# Altium schematic sheet Power.SchDoc
size A; SheetNumber: 2; SheetTotal: 5
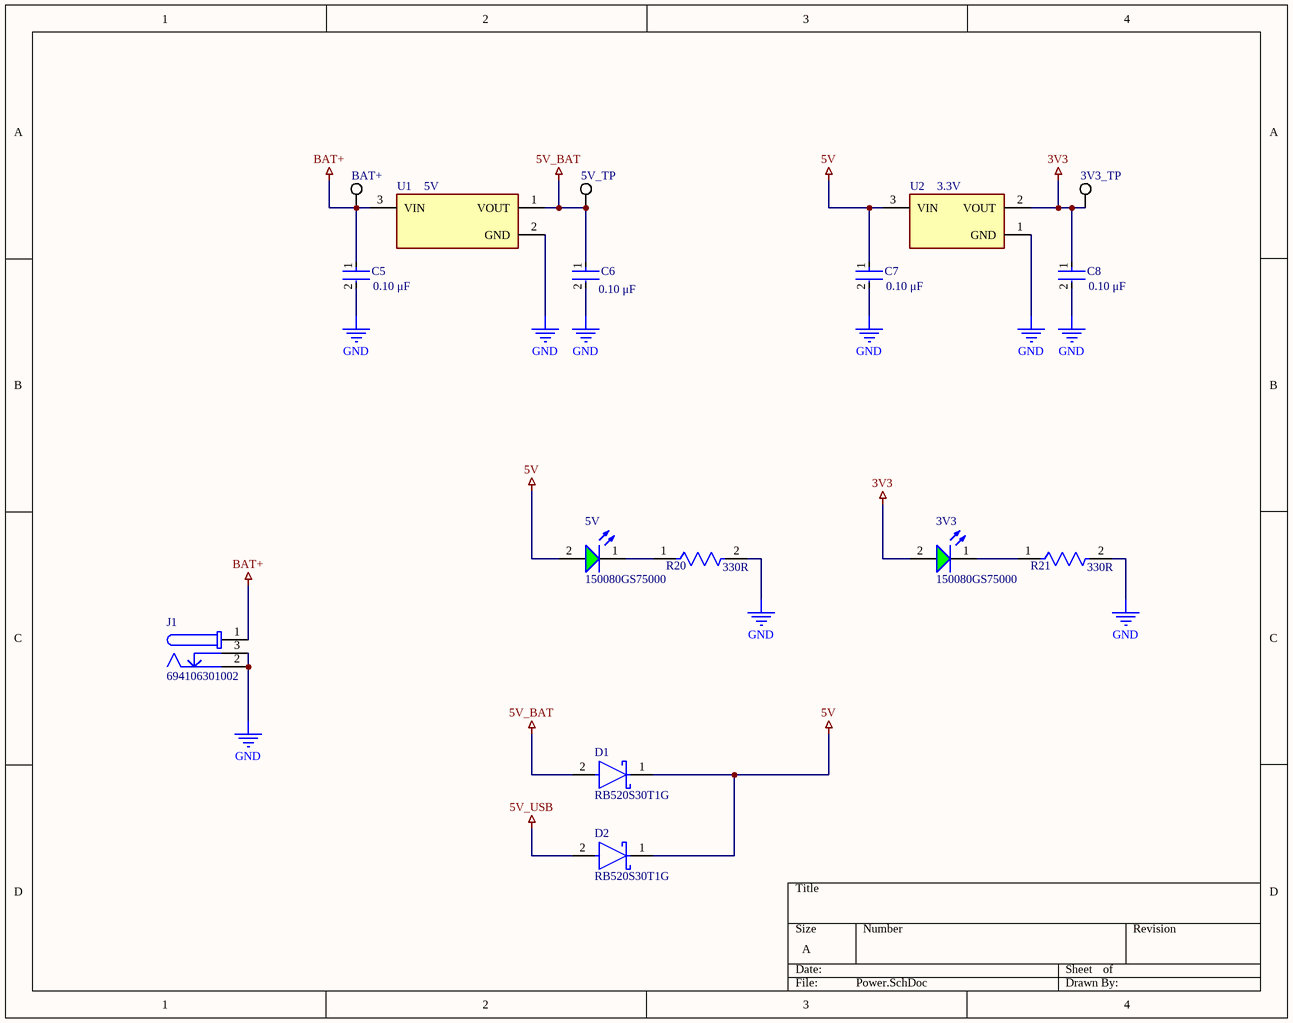
[diagram p0: Power.SchDoc]

## Parts
3V3  150080GS75000  [WL-SMCW_0805_150080xx75000]
3V3_TP  (no value)  [KSTN-5019_V]
5V  150080GS75000  [WL-SMCW_0805_150080xx75000]
5V_TP  (no value)  [KSTN-5019_V]
BAT+  (no value)  [KSTN-5019_V]
C5  Capacitance: 0.10 μF  [FP-C0603C-CF-MFG]  (hidden comment: C0603C104K5RACTU)
C6  Capacitance: 0.10 μF  [FP-C0603C-CF-MFG]  (hidden comment: C0603C104K5RACTU)
C7  Capacitance: 0.10 μF  [FP-C0603C-CF-MFG]  (hidden comment: C0603C104K5RACTU)
C8  Capacitance: 0.10 μF  [FP-C0603C-CF-MFG]  (hidden comment: C0603C104K5RACTU)
D1  RB520S30T1G  [FP-502-01-MFG]
D2  RB520S30T1G  [FP-502-01-MFG]
J1  694106301002  [694106301002]
R20  Resistance: 330R  [FP-CRCW0805-e3-MFG]  (hidden comment: CRCW0805330RFKEA)
R21  Resistance: 330R  [FP-CRCW0805-e3-MFG]  (hidden comment: CRCW0805330RFKEA)
U1  Output Voltage: 5V  [FP-SOT-89-7098166-MFG]  (hidden comment: L78L05ACUTR)
U2  Output Voltage: 3.3V  [FP-SOT23-MFG]  (hidden comment: AP2120N-3.3TRG1)

## Nets
3V3: 3V3.2(A) 3V3_TP.1 C8.1 U2.2(VOUT)
5V: 5V.2(A) C7.1 D1.1(C) D2.1(C) U2.3(VIN)
5V_BAT: 5V_TP.1 C6.1 D1.2(A) U1.1(VOUT)
5V_USB: D2.2(A)
BAT+: BAT+.1 C5.1 J1.1 U1.3(VIN)
GND: C5.2 C6.2 C7.2 C8.2 J1.2 J1.3 R20.2 R21.2 U1.2(GND) U2.1(GND)
Net3V3_1: 3V3.1(K) R21.1
Net5V_1: 5V.1(K) R20.1

## Library data of the parts
3V3 5V = CMP-1426-00007-2: NexarPartId: 29717780; Manufacturer: Wurth Electronics; Wavelength: 520nm; Forward Current: 100mA; Lens Style: Clear, Rectangular; Dominant Wavelength: 525nm; Max Junction Temperature (Tj): 95°C; Power Dissipation: 105mW; Luminous Intensity: 450mcd; Peak Wavelength: 515nm; Viewing Angle: 140°; Test Current: 20mA; Reverse Voltage: 5V; Forward Voltage: 3.2V; Description: Single Color LED, Green, Water Clear, 1.4mm; Shape: Rectangular; Channels: 1; Optoelectronic Device Type: SINGLE COLOR LED; Overall Height: 0.7mm; Mount: Surface Mount; REACH SVHC: Unknown; Min Operating Temperature: -40°C; Case Code (Imperial): 0805; Case/Package: 0805; Max Operating Temperature: 85°C; RoHS: Compliant; Length: 2mm; Height: 700µm; Width: 1.25mm; Color: Green; Case Code (Metric): 2012; Packaging: Tape and Reel; Max Reverse Voltage (DC): 5V; Supplier: Digikey; Supplier Part Number: 732-4983-1-ND; Manufacturer Part Number: 150080GS75000; Category: LEDs; Stock: 74088; Pricing: 1=0.19, 50=0.176, 100=0.151, 500=0.131 (USD); Mounting Technology: Surface Mount; Pins: 2; Luminous Intensity-Nom: 450mcd; Size: 1.4mm; Terminal Pitch: 2.1mm; Reach SVHC Compliant: Yes; RoHS Compliant: Yes; ComponentLink1URL: https://datasheet.ciiva.com:443/pdfs/VipMasterIC/IC/MIDC/MIDC-S-A0007455966/MIDC-S-A0007455966-1.pdf?src-supplier=IHS+Markit; ComponentLink1Description: https://datasheet.ciiva.com:443/pdfs/VipMasterIC/IC/MIDC/MIDC-S-A0007455966/MIDC-S-A0007455966-1.pdf?src-supplier=IHS+Markit; ComponentLink2URL: https://datasheet.ciiva.com/29563/150080gs75000-29563008.pdf?src-supplier=Digikey; ComponentLink2Description: https://datasheet.ciiva.com/29563/150080gs75000-29563008.pdf?src-supplier=Digikey; ComponentLink3URL: https://datasheet.ciiva.com/29279/759434-da-01-en-chipled-0805-w-kl-gruen-150080gs75000-29279039.pdf?src-supplier=Conrad; ComponentLink3Description: https://datasheet.ciiva.com/29279/759434-da-01-en-chipled-0805-w-kl-gruen-150080gs75000-29279039.pdf?src-supplier=Conrad
3V3_TP 5V_TP BAT+ = CMP-1672-00008-1: Test Point, 1 Position SMD, RoHS, Tape and Reel; Manufacturer: Keystone Electronics; Manufacturer Part Number: 5019; Connector Type: Interconnection Device; ComponentLink1Description: Manufacturer URL; Package Quantity: 1000; DatasheetVersion: 03/2014; Packaging: Tape and Reel; ComponentLink2URL: http://www.keyelco.com/product-pdf.cfm?p=1357; ComponentLink1URL: http://www.keyelco.com/; Mount: Surface Mount; Contact Plating: Silver; PackageDescription: 1-Pin Surface Mount Device, Body 3.81 x 2.03 mm; Pins: 1; RoHSCompliant: True; Mounting Technology: Surface Mount; ComponentLink2Description: Datasheet; PackageReference: 5019; Supplier: Digikey; Supplier Part Number: 36-5019CT-ND; RoHS: Yes; Category: Connectors; Stock: 174520; Pricing: 1=0.34, 25=0.2736, 100=0.2234, 250=0.20064, 500=0.19152 (USD); Reach SVHC Compliant: Yes; RoHS Compliant: Yes; ComponentLink3URL: https://datasheet.ciiva.com:443/pdfs/VipMasterIC/IC/KEYC/KEYC-S-A0003063693/KEYC-S-A0003063693-1.pdf?src-supplier=IHS+Markit; ComponentLink3Description: https://datasheet.ciiva.com:443/pdfs/VipMasterIC/IC/KEYC/KEYC-S-A0003063693/KEYC-S-A0003063693-1.pdf?src-supplier=IHS+Markit; ComponentLink4URL: https://datasheet.ciiva.com/16318/m60-2p61-16318395.pdf?src-supplier=Future+Electronics; ComponentLink4Description: https://datasheet.ciiva.com/16318/m60-2p61-16318395.pdf?src-supplier=Future+Electronics; ComponentLink5URL: https://datasheet.ciiva.com/14848/m60-2p61-14848438.pdf?src-supplier=Digikey; ComponentLink5Description: https://datasheet.ciiva.com/14848/m60-2p61-14848438.pdf?src-supplier=Digikey; ComponentLink6URL: https://datasheet.ciiva.com/14848/m60-2p61-14848439.pdf?src-supplier=Digikey; ComponentLink6Description: https://datasheet.ciiva.com/14848/m60-2p61-14848439.pdf?src-supplier=Digikey; ComponentLink7URL: https://datasheet.ciiva.com/14848/m60-2p61-14848437.pdf?src-supplier=Digikey; ComponentLink7Description: https://datasheet.ciiva.com/14848/m60-2p61-14848437.pdf?src-supplier=Digikey; ComponentLink8URL: https://datasheet.ciiva.com/16885/70182998-16885945.pdf?src-supplier=Allied+Electronics; ComponentLink8Description: https://datasheet.ciiva.com/16885/70182998-16885945.pdf?src-supplier=Allied+Electronics
C5-C8 = CMP-2006-03061-2: CAP CER 0.1UF 50V X7R 0603; Manufacturer: KEMET; Tolerance: 0.1; Temperature Coefficient: 30ppm/°C; Material: Ceramic; Automotive Grade: Grade 1; Value: 0.10 μF; Multilayer: Yes; Tolerance  (fill in as +-): 10%; Temperature: -55°C to +125°C; RoHS: TRUE; Temperature Range High: +125°C; Lead Free: Yes; Octopart: https://octopart.com/c0603c104k5ractu-kemet-139244; Digikey Description: CAP CER 0.1UF 50V X7R 0603; Category: Cap; Package: C0603C-CF; ComponentLink2Description: Datasheet; Temperature Range Low: -55°C; Device Class L1: Passive Components; Voltage Rating: 50 V; Automotive: Yes; Device Class L3: Ceramic Capacitors; ComponentLink2URL: https://api.kemet.com/component-edge/download/datasheet/C0603C100J5GACAUTO.pdf; Device Class L2: Capacitors; Manufacturer Part Number: C0603C104K5RACTU; Temperature Characteristic: X7R; Height: 0.87mm; Supplier: Digikey; Supplier Part Number: 399-C0603C104K5RAC7867CT-ND; Stock: 4063890; Pricing: 1=0.11, 10=0.074, 50=0.0424, 100=0.0329, 500=0.02474, 1000=0.01944 (USD); Mounting Technology: Surface Mount; Pins: 2; Dielectric Material: Ceramic; Package Shape: Rectangular; Case/Package: 0603; Terminal Finish: Nickel; Min Operating Temperature: -55°C; Max Operating Temperature: 125°C; JESD-609 Code: e3; Capacitor Type: Ceramic; Package Style: SMTMeter; Packaging: Tape and Reel; Tolerance (fill in as +-): 10%; Rated DC Voltage (URdc): 50V; Temperature Characteristics Code: X7R; Termination: Wraparound; Length: 1.6mm; Width: 0.8mm; Reach SVHC Compliant: Yes; RoHS Compliant: Yes; ComponentLink1URL: https://datasheet.ciiva.com:443/pdfs/VipMasterIC/IC/KEME/KEME-S-A0008991654/KEME-S-A0008991654-1.pdf?src-supplier=IHS+Markit; ComponentLink1Description: https://datasheet.ciiva.com:443/pdfs/VipMasterIC/IC/KEME/KEME-S-A0008991654/KEME-S-A0008991654-1.pdf?src-supplier=IHS+Markit
D1 D2 = CMP-1055-00482-2: DIODE SCHOTTKY 30V 200MA SOD523; Element Configuration: Single; Max Reverse Leakage Current: 1uA; Power Dissipation: 200mW; Forward Voltage: 600mV; Polarity: Standard; Min Operating Temperature: -55°C; Radiation Hardening: No; Average Rectified Current: 200mA; Height: 0.7mm; Package Quantity: 1; Number of Pins: 2; Forward Current: 200mA; Packaging: Tape and Reel; Max Repetitive Reverse Voltage (Vrrm): 30V; Max Forward Surge Current (Ifsm): 200mA; Peak Reverse Current: 1uA; Max Reverse Voltage (DC): 30V; Lead Free: Lead Free; Current Rating: 200mA; Output Current: 200mA; Contact Plating: Tin; Voltage Rating (DC): 30V; Max Operating Temperature: 150°C; Width: 0.9mm; REACH SVHC: No SVHC; Case/Package: SOD-523-2; Length: 1.3mm
J1 = CMP-1502-00188-2: NexarPartId: 52676100; Manufacturer: Wurth Electronics; Voltage Rating (DC): 20V; Gender: Male; Voltage Rating: 24V; Connector Type: Power; Insulation Resistance: 100MΩ; Current Rating: 5A; Shielding: Unshielded; Number of Contacts: 3; Color: Black; Housing Material: Polyamide; Contact Gender: Female; REACH SVHC: Unknown; Termination: Through Hole; Height: 11mm; RoHS: Compliant; Mount: Through Hole; Flammability Rating: UL94 V-0; Packaging: Bulk; Min Operating Temperature: -40°C; Contact Plating: Tin; Max Operating Temperature: 85°C; Operating Supply Voltage: 24V; Contact Material: Gold, Tin; Supplier: Digikey; Supplier Part Number: 732-5930-ND; Manufacturer Part Number: 694106301002; Category: Power Connectors; Stock: 12798; Pricing: 1=1.02, 10=0.97, 50=0.86, 100=0.8, 500=0.69, 1000=0.59 (USD); Contact Finish - Mating: NOT SPECIFIED; Reach SVHC Compliant: Yes; RoHS Compliant: Yes; ComponentLink1URL: https://datasheet.ciiva.com:443/pdfs/VipMasterIC/IC/MIDC/MIDC-S-A0001192814/MIDC-S-A0001192814-1.pdf?src-supplier=IHS+Markit; ComponentLink1Description: https://datasheet.ciiva.com:443/pdfs/VipMasterIC/IC/MIDC/MIDC-S-A0001192814/MIDC-S-A0001192814-1.pdf?src-supplier=IHS+Markit; ComponentLink2URL: http://www.mouser.com/ds/2/445/6941xx301002-469315.pdf?src-supplier=Mouser; ComponentLink2Description: http://www.mouser.com/ds/2/445/6941xx301002-469315.pdf?src-supplier=Mouser; ComponentLink3URL: http://www.farnell.com/cad/2130967.pdf?src-supplier=Element14; ComponentLink3Description: http://www.farnell.com/cad/2130967.pdf?src-supplier=Element14; ComponentLink4URL: https://katalog.we-online.de/em/datasheet/6941xx301002.pdf?src-supplier=Digikey; ComponentLink4Description: https://katalog.we-online.de/em/datasheet/6941xx301002.pdf?src-supplier=Digikey
R20 R21 = CMP-2001-03823-2: RES Thick Film, 330Ω, 1%, 0.125W, 100ppm/°C, 0805; Manufacturer: Vishay; Voltage Rating (DC): 150V; Max Power Dissipation: 125mW; Rated Temperature: 70°C; Value: 330R; Package Height: 0.45mm; Package Length: 2mm; Package Width: 1.25mm; Reference Standard: AEC-Q200; Mount: Surface Mount; Packaging: Tape and Reel; Min Operating Temperature: -55°C; Military Standard: Not; Case Code (Metric): 2012; Height: 0.02inch; Voltage Rating: 150V; Case/Package: 0805; Max Operating Temperature: 155°C; Width: 0.049inch; Case Code (Imperial): 0805; Termination: SMD/SMT; Lead Free: Lead Free; Contact Plating: Tin; Package Quantity: 10; Composition: Thick Film; Length: 2mm; Features: Automotive AEC-Q200; Depth: 1.25mm; Weight: 0.000194oz; Tolerance: 1%; Power Rating: 125mW; Number of Terminations: 2; Temperature Coefficient: 100ppm/°C; Supplier: Digikey; Supplier Part Number: 541-330CCT-ND; Manufacturer Part Number: CRCW0805330RFKEA; RoHS: Yes; Category: Chip SMD Resistors; Stock: 41783; Pricing: 1=0.1, 10=0.038, 50=0.0248, 100=0.021, 500=0.01462, 1000=0.01273 (USD); Mounting Technology: Surface Mount; Pins: 2; Terminal Finish: Nickel; Package Shape: Rectangular; JESD-609 Code: e3; Construction: Chip; Resistor Type: FIXED RESISTOR; Package Style: SMTMeter; Power: 125mW; Technology: METAL GLAZE/THICK FILM; Working Voltage: 150V; Reach SVHC Compliant: Yes; RoHS Compliant: Yes; ComponentLink1URL: https://datasheet.ciiva.com:443/pdfs/VipMasterIC/IC/VISH/VISH-S-A0007266705/VISH-S-A0007266705-1.pdf?src-supplier=IHS+Markit; ComponentLink1Description: https://datasheet.ciiva.com:443/pdfs/VipMasterIC/IC/VISH/VISH-S-A0007266705/VISH-S-A0007266705-1.pdf?src-supplier=IHS+Markit
U1 = CMP-0244-00407-2: IC REG LINEAR 5V 100MA SOT89-3; Manufacturer: STMicroelectronics; Output Voltage Accuracy: 4%; Number of Regulators: 1; Polarity: Positive; Quiescent Current: 6mA; Min Input Voltage: 7V; Power Supply Rejection Ratio (PSRR): 49dB; Output Type: Fixed; Max Input Voltage: 30V; Dropout Voltage: 1.7V; Package Body Material: Plastic; Max Supply Voltage: 20V; Line Regulation-Max: 0.15%; Load Regulation-Max: 0.06%; Output Current1-Max: 70mA; Output Voltage1-Max: 5.25V; Output Voltage1-Min: 4.75V; Package Equivalence Code: TO-243; Regulator Type: FIXED POSITIVE SINGLE OUTPUT STANDARD REGULATOR; Time @ Peak Reflow Temperature-Max (s): 30s; Voltage Tolerance-Max: 5%; Qualification Status: Not Qualified; Nominal Output Voltage: 5V; Radiation Hardening: No; Number of Pins: 3; Weight: 0.004603oz; Output Current: 100mA; Width: 2.6mm; Packaging: Tape and Reel; Length: 4.6mm; Max Output Current: 100mA; Min Operating Temperature: 0°C; Package Quantity: 1; Accuracy: 4%; Case/Package: SOT-89; Lead Free: Lead Free; Height: 1.6mm; Min Output Voltage: 5V; Contact Plating: Tin; Number of Outputs: 1; REACH SVHC: No SVHC; Mount: Surface Mount; Max Operating Temperature: 125°C; Supplier: Digikey; Supplier Part Number: 497-1183-1-ND; Manufacturer Part Number: L78L05ACUTR; RoHS: Yes; Category: Voltage Regulators - Linear; Stock: 92237; Pricing: 1=0.54, 10=0.464, 25=0.4328, 100=0.3461, 250=0.32144, 500=0.27198, 1000=0.21016 (USD); Pins: 3; Package Shape: Rectangular; Terminal Finish: Tin; JESD-609 Code: e3; Adjustability: FIXED; Dropout Voltage1-Nom: 1.7V; Input Voltage Absolute-Max: 30V; JESD-30 Code: R-PSSO-F3; Moisture Sensitivity Level: 1; Channels: 1; Operating Temperature, TJ-Max: 125°C; Operating Temperature, TJ-Min: 0°C; Output Voltage1-Nom: 5V; Package Style: SMALL OUTLINEMeter; Peak Reflow Temperature (Cel): 260°C; Surface Mount: Yes; Technology: BIPOLAR; Terminal Form: Flat; Terminal Position: SINGLE; Height - Seated (Max): 1.6mm; Terminal Pitch: 1.495mm; Reach SVHC Compliant: Yes; RoHS Compliant: Yes; ComponentLink1URL: https://datasheet.ciiva.com:443/pdfs/VipMasterIC/IC/SGST/SGST-S-A0002857926/SGST-S-A0002857926-1.pdf?src-supplier=IHS+Markit; ComponentLink1Description: https://datasheet.ciiva.com:443/pdfs/VipMasterIC/IC/SGST/SGST-S-A0002857926/SGST-S-A0002857926-1.pdf?src-supplier=IHS+Markit; ComponentLink2URL: https://datasheet.ciiva.com/1511/1868798-1511940.pdf?src-supplier=Element14; ComponentLink2Description: https://datasheet.ciiva.com/1511/1868798-1511940.pdf?src-supplier=Element14; ComponentLink3URL: https://datasheet.ciiva.com/22710/1868798-22710940.pdf?src-supplier=Element14; ComponentLink3Description: https://datasheet.ciiva.com/22710/1868798-22710940.pdf?src-supplier=Element14; ComponentLink4URL: https://datasheet.ciiva.com/7992/1868798-7992600.pdf?src-supplier=Element14; ComponentLink4Description: https://datasheet.ciiva.com/7992/1868798-7992600.pdf?src-supplier=Element14; ComponentLink5URL: https://datasheet.ciiva.com/2041/cd00000446-2041791.pdf?src-supplier=Digikey; ComponentLink5Description: https://datasheet.ciiva.com/2041/cd00000446-2041791.pdf?src-supplier=Digikey; ComponentLink6URL: https://datasheet.ciiva.com/2041/cd00000446-2041790.pdf?src-supplier=Digikey; ComponentLink6Description: https://datasheet.ciiva.com/2041/cd00000446-2041790.pdf?src-supplier=Digikey; ComponentLink7URL: https://datasheet.ciiva.com/2041/cd00000446-2041792.pdf?src-supplier=Digikey; ComponentLink7Description: https://datasheet.ciiva.com/2041/cd00000446-2041792.pdf?src-supplier=Digikey; ComponentLink8URL: https://datasheet.ciiva.com/4882/cd00000446-355303-4882429.pdf?src-supplier=Mouser; ComponentLink8Description: https://datasheet.ciiva.com/4882/cd00000446-355303-4882429.pdf?src-supplier=Mouser; ComponentLink9URL: https://datasheet.ciiva.com/16393/cd00000446-16393708.pdf?src-supplier=Future+Electronics; ComponentLink9Description: https://datasheet.ciiva.com/16393/cd00000446-16393708.pdf?src-supplier=Future+Electronics
U2 = CMP-12756-000008-1: IC REG LINEAR 3.3V 150MA SOT23; Manufacturer: Diodes Inc.; Min Supply Voltage: 2V; Standoff Height: 0.013mm; Max Junction Temp: +85°C; Output Type: Fixed; Max Supply Voltage: 6V; Accuracy Percentage: 2%; Nominal Supply Current: 25uA; Dropout Voltage: 300mV; Number Of Outputs: 1; Package Body Material: Plastic; Input Voltage Absolute-Max: 6.5V; Line Regulation-Max: 0.016%; Load Regulation-Max: 0.04%; Output Current1-Max: 100mA; Output Voltage1-Max: 3.366V; Output Voltage1-Min: 3.234V; Package Equivalence Code: TO-236; Regulator Type: FIXED POSITIVE SINGLE OUTPUT LDO REGULATOR; Time @ Peak Reflow Temperature-Max (s): 30s; Qualification Status: Not Qualified; Footprint Url: https://www.diodes.com/assets/Package-Files/SOT23.pdf; Category: IC; Manufacturer Part Number: AP2120N-3.3TRG1; ComponentLink2Description: Datasheet; Device Class L1: Integrated Circuits (ICs); Octopart: https://octopart.com/ap2120n-3.3trg1-diodes+inc.-30954573; Temperature Range Low: -40°C; Temperature: -40°C to +85°C; Temperature Range High: +85°C; Package: SOT23; Digikey Description: IC REG LINEAR 3.3V 150MA SOT23; Height: 1.1mm; Mouser Description: AP2120 Series 3.3 V 0.15 A Surface Mount CMOS LDO Regulator - SOT23; RoHS: TRUE; ComponentLink2URL: https://www.diodes.com/assets/Package-Files/SOT23.pdf; Device Class L2: Power Management ICs; Device Class L3: Voltage Regulators - Linear; Output Current: 150mA; Ipc Land Pattern Name: SOT92P240X102-3; Lead Free: Yes; Automotive: No; Supplier: Digikey; Supplier Part Number: AP2120N-3.3TRG1DICT-ND; Stock: 949628; Pricing: 1=0.38, 10=0.281, 25=0.246, 100=0.1592, 250=0.1318, 500=0.10544, 1000=0.08084 (USD); Case/Package: TSSOP; Pins: 3; Package Shape: Rectangular; Terminal Finish: Tin; JESD-609 Code: e3; JESD-30 Code: R-PDSO-G3; Package Style: SMALL OUTLINE, THIN PROFILE, SHRINK PITCHMeter; Surface Mount: Yes; Technology: CMOS; Terminal Form: Gull Wing; Terminal Position: DUAL; Adjustability: FIXED; Dropout Voltage1-Max: 300mV; Dropout Voltage1-Nom: 300mV; Min Input Voltage: 2V; Moisture Sensitivity Level: 3; Channels: 1; Operating Temperature, TJ-Max: 85°C; Operating Temperature, TJ-Min: -40°C; Output Voltage1-Nom: 3.3V; Packaging: Tape and Reel; Peak Reflow Temperature (Cel): 260°C; Voltage Tolerance-Max: 2%; Length: 2.9mm; Width: 1.3mm; Height - Seated (Max): 1.2mm; Terminal Pitch: 0.95mm; Reach SVHC Compliant: Yes; RoHS Compliant: Yes; ComponentLink1URL: https://datasheet.ciiva.com:443/pdfs/VipMasterIC/IC/DIOD/DIOD-S-A0008513436/DIOD-S-A0008513436-1.pdf?src-supplier=IHS+Markit; ComponentLink1Description: https://datasheet.ciiva.com:443/pdfs/VipMasterIC/IC/DIOD/DIOD-S-A0008513436/DIOD-S-A0008513436-1.pdf?src-supplier=IHS+Markit; ComponentLink3URL: https://datasheet.ciiva.com/29569/ap2120-29569979.pdf?src-supplier=Digikey; ComponentLink3Description: https://datasheet.ciiva.com/29569/ap2120-29569979.pdf?src-supplier=Digikey; ComponentLink4URL: https://datasheet.ciiva.com/29569/ap2120-29569977.pdf?src-supplier=Digikey; ComponentLink4Description: https://datasheet.ciiva.com/29569/ap2120-29569977.pdf?src-supplier=Digikey; ComponentLink5URL: https://datasheet.ciiva.com/30016/ap2120-30016809.pdf?src-supplier=Avnet; ComponentLink5Description: https://datasheet.ciiva.com/30016/ap2120-30016809.pdf?src-supplier=Avnet; ComponentLink6URL: https://datasheet.ciiva.com/29569/ap2120-29569978.pdf?src-supplier=Digikey; ComponentLink6Description: https://datasheet.ciiva.com/29569/ap2120-29569978.pdf?src-supplier=Digikey